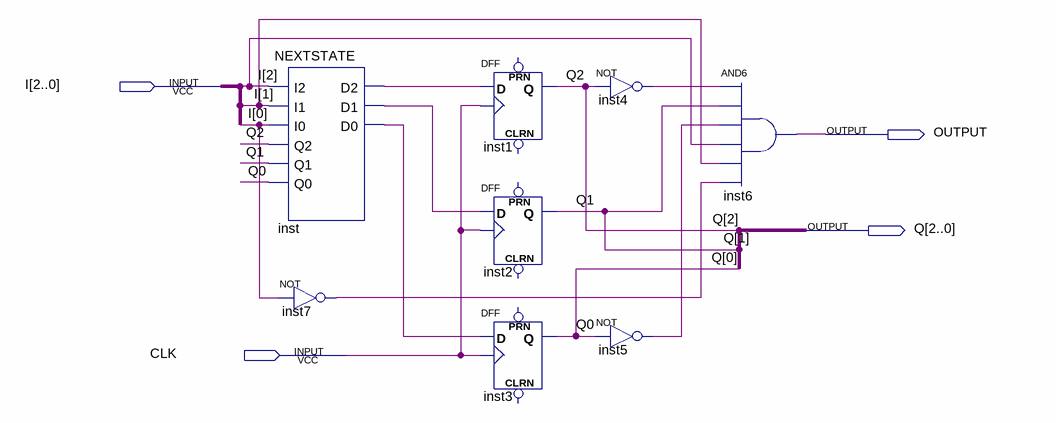
[diagram p0: schematic sheet]
// Quartus schematic MEALY_MSSV.bdf as structural Verilog: 8 symbols, 4 pins
module MEALY_MSSV (
  input  [2:0] I,
  input  CLK,
  output OUTPUT,
  output [2:0] Q
);

  wire inst4_out, inst5_out, inst7_out, inst_d0, inst_d1, inst_d2;

  NEXTSTATE inst (
    .I2(I[2]), .I1(I[1]), .I0(I[0]), .Q2(Q[2]), .Q1(Q[1]), .Q0(Q[0]), .D2(inst_d2), .D1(inst_d1), .D0(inst_d0));
  not inst7 (inst7_out, I[0]);
  DFF inst1 (.CLK(CLK), .D(inst_d2), .Q(Q[2]));  // open: CLRN, PRN
  DFF inst2 (.CLK(CLK), .D(inst_d1), .Q(Q[1]));  // open: CLRN, PRN
  DFF inst3 (.CLK(CLK), .D(inst_d0), .Q(Q[0]));  // open: CLRN, PRN
  not inst4 (inst4_out, Q[2]);
  not inst5 (inst5_out, Q[0]);
  and inst6 (OUTPUT, inst4_out, Q[1], inst5_out, I[2], I[1], inst7_out);
endmodule
